# Altium project clock.PrjPcb (part 2 of 2)

## Sheet Beeper.SchDoc
size A4
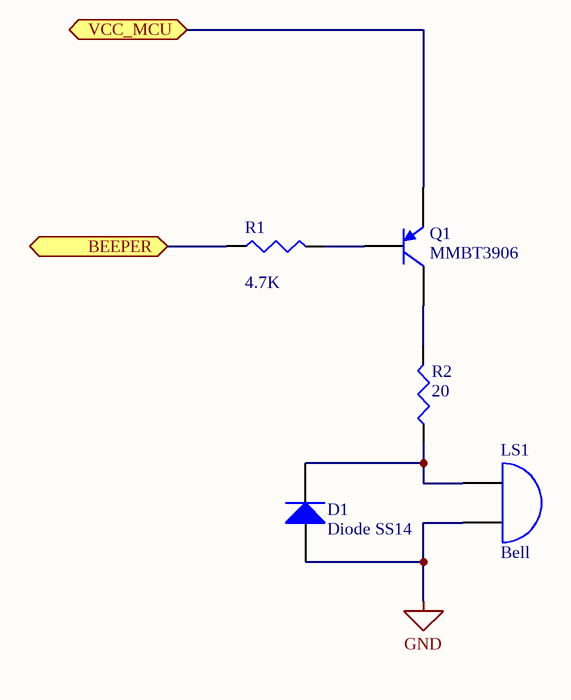
[diagram p13: Beeper.SchDoc]

### Parts
D1  Diode SS14  [SMA]
LS1  Bell  [BEEPER_SMD]
Q1  MMBT3906  [SOT23-3-PNP]
R1  value 4.7K  [0603]  (hidden comment: Res3)
R2  value 20  [0603]  (hidden comment: Res3)

### Ports
BEEPER (bidir), VCC_MCU (bidir)

### Nets
GND: D1.1(A) LS1.2(B)
VCC_MCU: Q1.3(E) ; port VCC_MCU
NetD1_2: D1.2(K) LS1.1(A) R2.1
NetQ1_1: Q1.1(C) R2.2
NetQ1_2: Q1.2(B) R1.2
NetR1_1: R1.1 ; port BEEPER

### Library data of the parts
D1 = Diode 1N4005: 1 Amp General Purpose Rectifier; Published: 8-Jun-2000; LatestRevisionDate: 17-Jul-2002; LatestRevisionNote: Re-released for DXP Platform.; DatasheetVersion: 1998; PackageVersion: Aug-1999; PackageReference: DO-41; Publisher: Altium Limited; PackageDescription: Diode, Axial; Body 5.2 x 2.7 mm (LxDia. max), Lead Dia. 0.86 mm (max); Code_JEDEC: DO-204-AL; ComponentLink1Description: Manufacturer Link; ComponentLink1URL: http://www.fairchildsemi.com/; ComponentLink2Description: Datasheet; ComponentLink2URL: http://www.fairchildsemi.com/ds/1N%2F1N4001.pdf
LS1 = Bell: Electrical Bell; Published: 24-Mar-1999; LatestRevisionDate: 17-Jul-2002; LatestRevisionNote: Re-released for DXP Platform.; PackageReference: PIN2; Publisher: Altium Limited
Q1 = PNP: PNP Bipolar Transistor; Published: 8-Jun-2000; LatestRevisionDate: 29-May-2009; LatestRevisionNote: IPC-7351 Footprint Added.; PackageVersion: Aug-1999; PackageReference: SOT-23B; Publisher: Altium Limited; PackageDescription: 3-Pin SOT-23 Package 0.95 mm Pitch, 2.4 mm Lead Span
R1 R2 = Res3: Resistor; Published: 8-Jun-2000; LatestRevisionDate: 29-May-2009; LatestRevisionNote: IPC-7351 Footprint Added.; PackageReference: J1-0603; Publisher: Altium Limited; PackageDescription: Chip Resistor

## Sheet Power_Adc.SchDoc
size A4
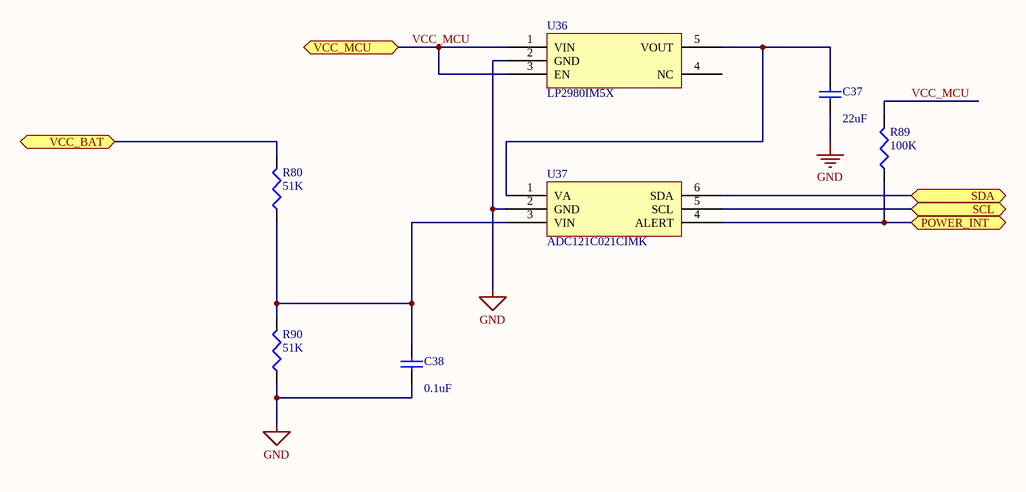
[diagram p14: Power_Adc.SchDoc]

### Parts
C37  value 22uF  [1206]  (hidden comment: Cap Semi)
C38  value 0.1uF  [0603]  (hidden comment: Cap Semi)
R80  value 51K  [0805]  (hidden comment: Res3)
R89  value 100K  [0603]  (hidden comment: Res3)
R90  value 51K  [0805]  (hidden comment: Res3)
U36  LP2980IM5X  [DDC-5]
U37  ADC121C021CIMK  [DDC-6]

### Ports
POWER_INT (bidir), SCL (bidir), SDA (bidir), VCC_BAT (bidir), VCC_MCU (bidir)

### Nets
GND: C37.1 C38.1 R90.1 U36.2(GND) U37.2(GND)
VCC_BAT: R80.2 ; port VCC_BAT
VCC_MCU: R89.2 U36.1(VIN) U36.3(EN) ; port VCC_MCU
POWER_INT: R89.1 U37.4(ALERT) ; port POWER_INT
SCL: U37.5(SCL) ; port SCL
SDA: U37.6(SDA) ; port SDA
NetC37_2: C37.2 U36.5(VOUT) U37.1(VA)
NetC38_2: C38.2 R80.1 R90.2 U37.3(VIN)

Not connected (* = marked no-connect by the designer): U36 4(NC)

### Library data of the parts
C37 C38 = Cap Semi: Capacitor (Semiconductor SIM Model); Published: 8-Jun-2000; LatestRevisionDate: 29-May-2009; LatestRevisionNote: IPC-7351 Footprint Added.; PackageReference: C1206; Publisher: Altium Limited; PackageDescription: Chip Capacitor
R80 R89 R90 = Res3: Resistor; Published: 8-Jun-2000; LatestRevisionDate: 29-May-2009; LatestRevisionNote: IPC-7351 Footprint Added.; PackageReference: J1-0603; Publisher: Altium Limited; PackageDescription: Chip Resistor

## Sheet Control.SchDoc
size A2
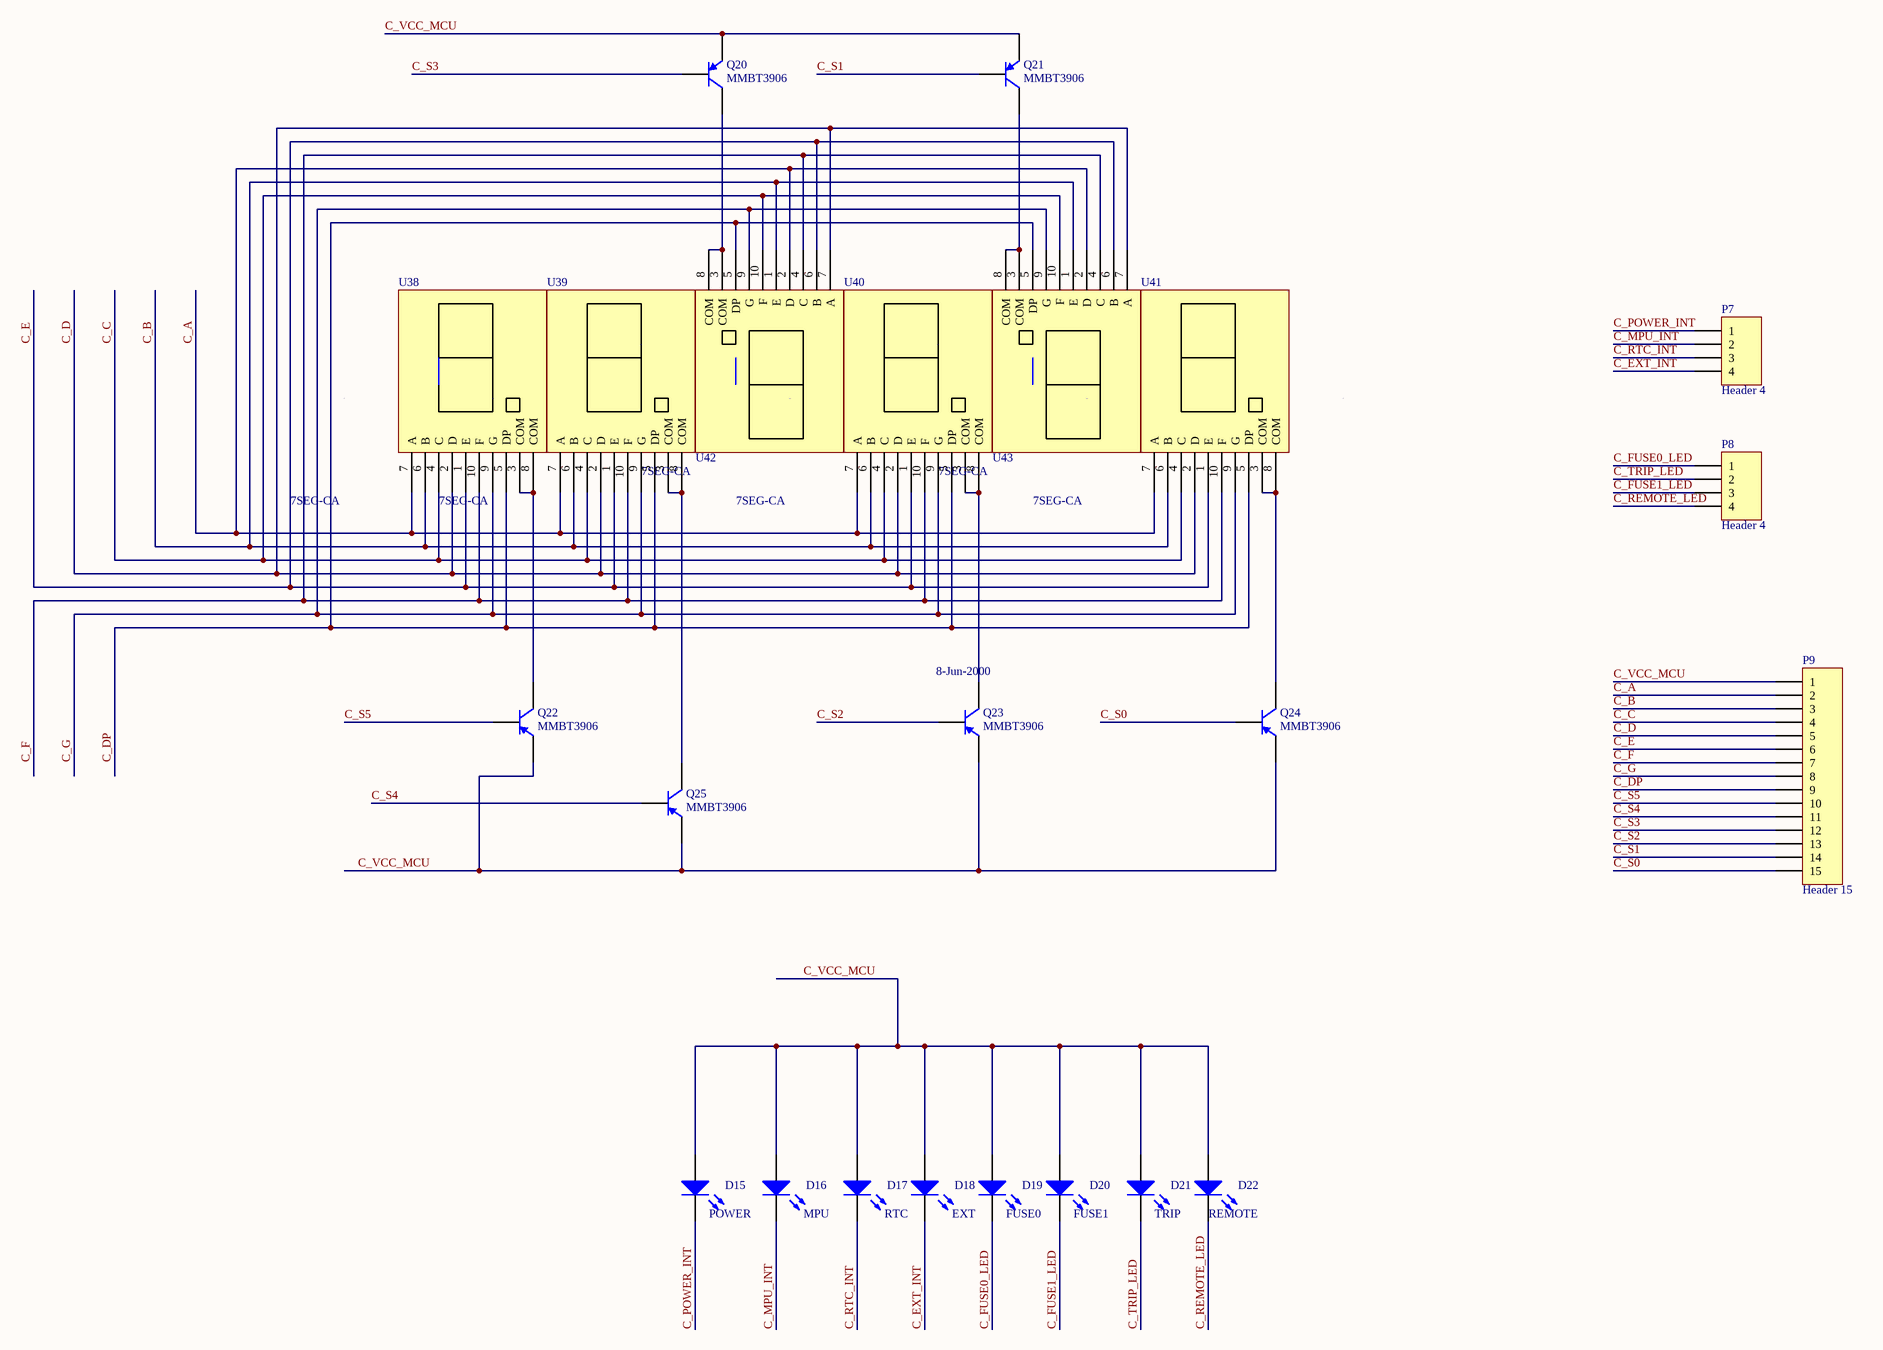
[diagram p15: Control.SchDoc]

### Parts
D15  Infor: POWER  [0603D]  (hidden comment: LED)
D16  Info: MPU  [0603D]  (hidden comment: LED)
D17  Info: RTC  [0603D]  (hidden comment: LED)
D18  Info: EXT  [0603D]  (hidden comment: LED)
D19  Info: FUSE0  [0603D]  (hidden comment: LED)
D20  Info: FUSE1  [0603D]  (hidden comment: LED)
D21  Info: TRIP  [0603D]  (hidden comment: LED)
D22  Info: REMOTE  [0603D]  (hidden comment: LED)
P7  Header 4  [HDR1X4]
P8  Header 4  [HDR1X4]
P9  Header 15  [HDR1X15]
Q20  MMBT3906  [SOT23-3-PNP]
Q21  MMBT3906  [SOT23-3-PNP]
Q22  MMBT3906  [SOT23-3-PNP]
Q23  MMBT3906  Published: 8-Jun-2000  [SOT23-3-PNP]
Q24  MMBT3906  [SOT23-3-PNP]
Q25  MMBT3906  [SOT23-3-PNP]
U38  7SEG-CA  [8SEC-CA-28]
U39  7SEG-CA  [8SEC-CA-28]
U40  7SEG-CA  [8SEC-CA-28]
U41  7SEG-CA  [8SEC-CA-28]
U42  7SEG-CA  [8SEC-CA-28]
U43  7SEG-CA  [8SEC-CA-28]

### Nets
C_A: P9.2 U38.7(A) U39.7(A) U40.7(A) U41.7(A) U42.2(D) U43.2(D)
C_B: P9.3 U38.6(B) U39.6(B) U40.6(B) U41.6(B) U42.1(E) U43.1(E)
C_C: P9.4 U38.4(C) U39.4(C) U40.4(C) U41.4(C) U42.10(F) U43.10(F)
C_D: P9.5 U38.2(D) U39.2(D) U40.2(D) U41.2(D) U42.7(A) U43.7(A)
C_DP: P9.9 U38.5(DP) U39.5(DP) U40.5(DP) U41.5(DP) U42.5(DP) U43.5(DP)
C_E: P9.6 U38.1(E) U39.1(E) U40.1(E) U41.1(E) U42.6(B) U43.6(B)
C_EXT_INT: D18.2(K) P7.4
C_F: P9.7 U38.10(F) U39.10(F) U40.10(F) U41.10(F) U42.4(C) U43.4(C)
C_FUSE0_LED: D19.2(K) P8.1
C_FUSE1_LED: D20.2(K) P8.3
C_G: P9.8 U38.9(G) U39.9(G) U40.9(G) U41.9(G) U42.9(G) U43.9(G)
C_MPU_INT: D16.2(K) P7.2
C_POWER_INT: D15.2(K) P7.1
C_REMOTE_LED: D22.2(K) P8.4
C_RTC_INT: D17.2(K) P7.3
C_S0: P9.15 Q24.2(B)
C_S1: P9.14 Q21.2(B)
C_S2: P9.13 Q23.2(B)
C_S3: P9.12 Q20.2(B)
C_S4: P9.11 Q25.2(B)
C_S5: P9.10 Q22.2(B)
C_TRIP_LED: D21.2(K) P8.2
C_VCC_MCU: D15.1(A) D16.1(A) D17.1(A) D18.1(A) D19.1(A) D20.1(A) D21.1(A) D22.1(A) P9.1 Q20.3(E) Q21.3(E) Q22.3(E) Q23.3(E) Q24.3(E) Q25.3(E)
NetQ20_1: Q20.1(C) U42.3(COM) U42.8(COM)
NetQ21_1: Q21.1(C) U43.3(COM) U43.8(COM)
NetQ22_1: Q22.1(C) U38.3(COM) U38.8(COM)
NetQ23_1: Q23.1(C) U40.3(COM) U40.8(COM)
NetQ24_1: Q24.1(C) U41.3(COM) U41.8(COM)
NetQ25_1: Q25.1(C) U39.3(COM) U39.8(COM)

### Library data of the parts
D15 D18-D22 = LED2: Typical RED, GREEN, YELLOW, AMBER GaAs LED; Published: 8-Jun-2000; LatestRevisionDate: 17-Jul-2002; LatestRevisionNote: Re-released for DXP Platform.; PackageVersion: Feb-2002; PackageReference: 3.2X1.6X1.1; Publisher: Altium Limited; PackageDescription: SM LED; 2 Flat Leads
  D15: Value: Yellow
  D18: Value: Green
  D19-D22: Value: Red
D16 D17 = LED2: Typical RED, GREEN, YELLOW, AMBER GaAs LED; Value: Blue; Published: 8-Jun-2000; LatestRevisionDate: 17-Jul-2002; LatestRevisionNote: Re-released for DXP Platform.; PackageVersion: Feb-2002; PackageReference: 3.2X1.6X1.1; Publisher: Altium Limited; PackageDescription: SM LED; 2 Flat Leads
P7 P8 = Header 4: Header, 4-Pin; LatestRevisionDate: 17-Jul-2002; LatestRevisionNote: Re-released for DXP Platform.; Publisher: Altium Limited
P9 = Header 15: Header, 15-Pin; LatestRevisionDate: 17-Jul-2002; LatestRevisionNote: Re-released for DXP Platform.; Publisher: Altium Limited
Q20-Q25 = PNP: PNP Bipolar Transistor; LatestRevisionDate: 29-May-2009; LatestRevisionNote: IPC-7351 Footprint Added.; PackageVersion: Aug-1999; PackageReference: SOT-23B; Publisher: Altium Limited; PackageDescription: 3-Pin SOT-23 Package 0.95 mm Pitch, 2.4 mm Lead Span
  Q20-Q22 Q24 Q25: Published: 8-Jun-2000

## Sheet Extport.SchDoc
size A4
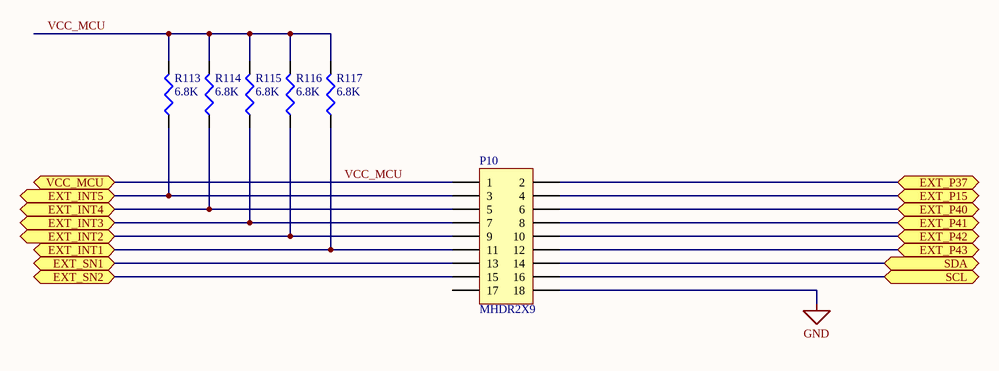
[diagram p16: Extport.SchDoc]

### Parts
P10  MHDR2X9  [MHDR2X9]
R113  value 6.8K  [0603]  (hidden comment: Res3)
R114  value 6.8K  [0603]  (hidden comment: Res3)
R115  value 6.8K  [0603]  (hidden comment: Res3)
R116  value 6.8K  [0603]  (hidden comment: Res3)
R117  value 6.8K  [0603]  (hidden comment: Res3)

### Ports
EXT_INT1 (bidir), EXT_INT2 (bidir), EXT_INT3 (bidir), EXT_INT4 (bidir), EXT_INT5 (bidir), EXT_P15 (bidir), EXT_P37 (bidir), EXT_P40 (bidir), EXT_P41 (bidir), EXT_P42 (bidir), EXT_P43 (bidir), EXT_SN1 (bidir), EXT_SN2 (bidir), SCL (bidir), SDA (bidir), VCC_MCU (bidir)

### Nets
GND: P10.18
VCC_MCU: P10.1 R113.2 R114.2 R115.2 R116.2 R117.2 ; port VCC_MCU
SCL: P10.16 ; port SCL
SDA: P10.14 ; port SDA
NetP10_2: P10.2 ; port EXT_P37
NetP10_3: P10.3 R113.1 ; port EXT_INT5
NetP10_4: P10.4 ; port EXT_P15
NetP10_5: P10.5 R114.1 ; port EXT_INT4
NetP10_6: P10.6 ; port EXT_P40
NetP10_7: P10.7 R115.1 ; port EXT_INT3
NetP10_8: P10.8 ; port EXT_P41
NetP10_9: P10.9 R116.1 ; port EXT_INT2
NetP10_10: P10.10 ; port EXT_P42
NetP10_11: P10.11 R117.1 ; port EXT_INT1
NetP10_12: P10.12 ; port EXT_P43
NetP10_13: P10.13 ; port EXT_SN1
NetP10_15: P10.15 ; port EXT_SN2

Not connected (* = marked no-connect by the designer): P10 17

### Library data of the parts
P10 = MHDR2X9: Header, 9-Pin, Dual row; LatestRevisionDate: 17-Jul-2002; LatestRevisionNote: Re-released for DXP Platform.; Publisher: Altium Limited
R113-R117 = Res3: Resistor; Published: 8-Jun-2000; LatestRevisionDate: 29-May-2009; LatestRevisionNote: IPC-7351 Footprint Added.; PackageReference: J1-0603; Publisher: Altium Limited; PackageDescription: Chip Resistor

## Nets that join several sheets
GND: Power (12 pins), MCU (18 pins), RTC (10 pins), Fuse (11 pins), MPU (5 pins), Hg (5 pins), Thermo (U9.2 U9.5 U10.2), Indictor (C3.1 C4.1 U12.1 U13.7), Radio (R84.1), Serial_Hub (U8.2 U8.3 U8.12 U8.21), Int_Hub (5 pins), Remote (U32.10 U33.9 U34.4 U35.7), Beeper (D1.1 LS1.2), Power_Adc (5 pins), Extport (P10.18)
POWER_GND: Power (24 pins), MCU (6 pins), Fuse (K1.6 K2.6)
VCC_5V: Power (11 pins), Fuse (K1.3 K2.3)
VCC_BAT: Power (9 pins), Power_Adc (R80.2)
VCC_IN: Power (9 pins), MCU (Q12.3 R54.2 U19.6), Radio (C21.2 U27.3)
VCC_MCU: Power (5 pins), MCU (10 pins), RTC (D5.1 R18.2 R19.2 U7.2), Fuse (Q11.3), MPU (5 pins), Hg (Q2.3), Thermo (5 pins), Indictor (7 pins), Radio (Q18.3), Serial_Hub (U8.24), Int_Hub (17 pins), Remote (6 pins), Beeper (Q1.3), Power_Adc (R89.2 U36.1 U36.3), Extport (6 pins)
VCC_USB: Power (Q15.3), MCU (5 pins)
EXT_INT: MCU (R108.1 U17.44), Int_Hub (R10.1 U5.1 U44.9)
MOD: MCU (D11.2 R57.2 U17.24 U19.1), Remote (U35.4)
MPU_INT: MCU (R106.1 U17.42), MPU (R61.1 U21.8), Int_Hub (U44.5)
NetK1_5: Fuse (K1.5 R33.2), Int_Hub (U6.4)
NetK2_5: Fuse (K2.5 R34.2), Int_Hub (U6.2)
NetP1_2: Fuse (P1.2 R24.2), Int_Hub (U6.6)
NetP10_2: MCU (U17.13), Extport (P10.2)
NetP10_3: Int_Hub (U5.20), Extport (P10.3 R113.1)
NetP10_4: MCU (U17.1), Extport (P10.4)
NetP10_5: Int_Hub (U5.19), Extport (P10.5 R114.1)
NetP10_6: MCU (U17.17), Extport (P10.6)
NetP10_7: Int_Hub (U5.18), Extport (P10.7 R115.1)
NetP10_8: MCU (U17.28), Extport (P10.8)
NetP10_9: Int_Hub (U5.17), Extport (P10.9 R116.1)
NetP10_10: MCU (U17.39), Extport (P10.10)
NetP10_11: Int_Hub (U5.16), Extport (P10.11 R117.1)
NetP10_12: MCU (U17.6), Extport (P10.12)
NetP10_13: Serial_Hub (U8.8), Extport (P10.13)
NetP10_15: Serial_Hub (U8.20), Extport (P10.15)
NetQ2_2: Hg (Q2.2), Serial_Hub (U8.5), Int_Hub (U6.19)
NetQ11_2: Fuse (Q11.2), Serial_Hub (U8.4), Int_Hub (U6.1)
NetQ14_2: Power (Q14.2), MCU (U17.12)
NetQ18_2: Radio (Q18.2), Serial_Hub (U8.7)
NetQ19_2: Serial_Hub (U8.6), Remote (Q19.2)
NetR1_1: MCU (U17.40), Beeper (R1.1)
NetR3_1: Hg (R3.1 U1.2), Int_Hub (U6.11)
NetR4_1: Hg (R4.1 U3.2), Int_Hub (U6.15)
NetR5_1: Hg (R5.1 U2.2), Int_Hub (U6.13)
NetR6_1: Hg (R6.1 U4.2), Int_Hub (U6.17)
NetR8_1: MCU (R112.2), Int_Hub (R8.1 U5.4 U6.18)
NetR9_1: MCU (R111.1), Int_Hub (R9.1 U5.10 U6.14)
NetR11_1: MCU (U17.9), Indictor (R43.2), Int_Hub (R11.1 U44.3)
NetR12_1: MCU (R110.2), Int_Hub (R12.1 U5.5 U6.16)
NetR19_1: MCU (U17.10), RTC (R19.1 U7.1)
NetR20_1: Thermo (R20.1 U9.3), Int_Hub (U5.11)
NetR21_1: Thermo (R21.1 U10.3), Int_Hub (U5.13)
NetR22_1: Fuse (R22.1), Serial_Hub (U8.14)
NetR25_1: Fuse (R25.1), Serial_Hub (U8.13)
NetR26_1: Fuse (R26.1), Serial_Hub (U8.11)
NetR28_1: Fuse (R28.1), Serial_Hub (U8.10)
NetR30_1: Fuse (R30.1), Serial_Hub (U8.9)
NetR39_1: Indictor (R39.1 U12.4), Remote (U35.12)
NetR41_2: Power (U24.7), Indictor (R41.2 U13.6)
NetR42_2: Power (U24.6), Indictor (R42.2 U13.12)
NetR87_1: Int_Hub (U5.14), Remote (R87.1 U35.8)
NetR88_1: Int_Hub (U5.15), Remote (R88.1 U35.2)
NetR109_2: MCU (R109.2), Remote (U35.10)
NetU8_15: Serial_Hub (U8.15), Remote (U35.13)
NetU8_16: Indictor (U13.1), Serial_Hub (U8.16)
NetU8_17: Indictor (U13.11), Serial_Hub (U8.17)
NetU8_18: Radio (U31.12), Serial_Hub (U8.18)
NetU8_19: Radio (U31.5), Serial_Hub (U8.19)
POWER_INT: MCU (R105.1 U17.43), Int_Hub (U44.4), Power_Adc (R89.1 U37.4)
POWER_ON: Power (U25.12), MCU (Q12.1 R59.2 U19.5)
RTC_INT: MCU (R107.1 U17.41), RTC (R18.1 U7.3), Int_Hub (U44.10)
SCL: MCU (R51.1 U17.3 U18.6), RTC (U7.16), MPU (U21.14), Thermo (U9.1 U10.1), Radio (L5.1), Serial_Hub (U8.22), Int_Hub (U5.22), Power_Adc (U37.5), Extport (P10.16)
SDA: MCU (R52.1 U17.2 U18.5), RTC (U7.15), MPU (U21.13), Thermo (U9.6 U10.6), Radio (L4.1), Serial_Hub (U8.23), Int_Hub (U5.23), Power_Adc (U37.6), Extport (P10.14)
SET: MCU (D12.2 R56.1 U17.25 U20.2), Remote (U35.6)